# Altium schematic sheet gongye-small-原理图-11-8.SchDoc
size A4
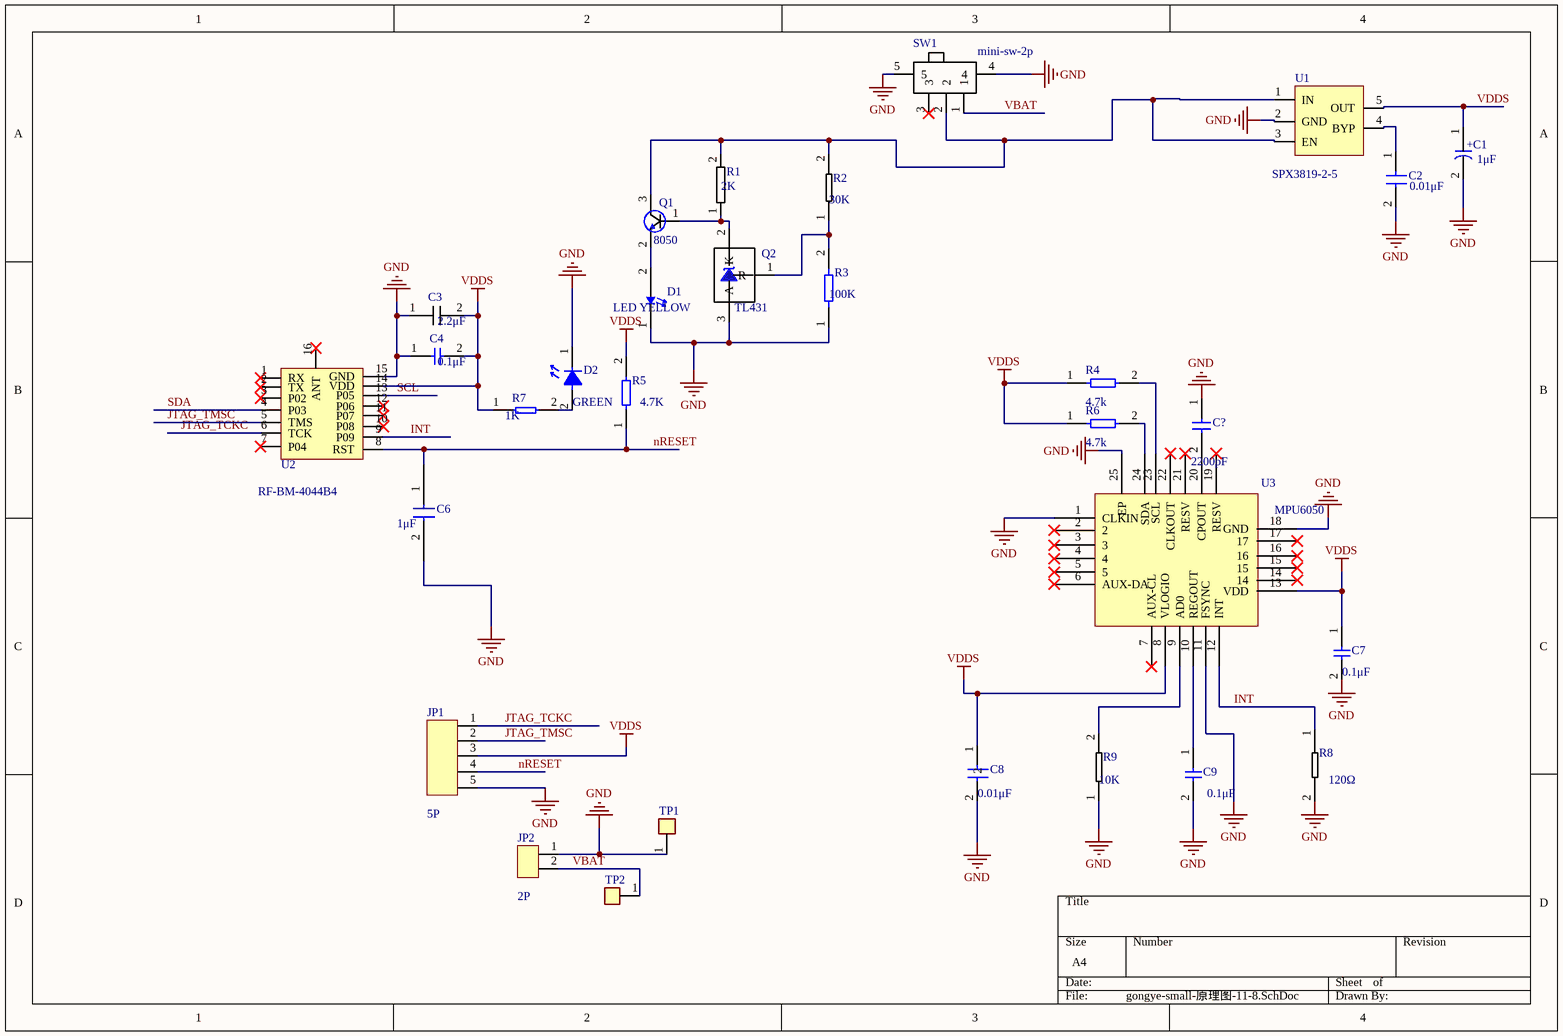
[diagram p0: gongye-small-原理图-11-8.SchDoc]

## Parts
C1  C  1μF TAN  [C 1uF tan]  (value not drawn)
C2  C 0.01μF  [0402--]  (value not drawn)
C3  C 2.2μF  [0402--]  (value not drawn)
C4  C 0.1μF  [0402--]  (value not drawn)
C6  C 1μF  [0402--]  (value not drawn)
C7  C 0.1μF  [0402--]  (value not drawn)
C8  C 0.01μF  [0402--]  (value not drawn)
C9  C 0.1μF  [0402--]  (value not drawn)
C?  C 2200pF  [0402--]  (value not drawn)
D1  D LED yellow  [D LED YELLOW-0603]  (value not drawn)
D2  D LED  [LED-GREEN-BEIGUANG-1206]  (value not drawn)
JP1  JP-5P  [5p-paizhen-1.27]  (value not drawn)
JP2  JP-2P  [2p-cixi-hanpan-3mm]  (value not drawn)
Q1  8050  [8050]
Q2  TL431  [TL431]
R1  R  2K  [0402--]  (value not drawn)
R2  R 30K  [0402--]  (value not drawn)
R3  R 100K  [0402--]  (value not drawn)
R4  R 4.7k  [0402--]  (value not drawn)
R5  R 4.7k  [0402--]  (value not drawn)
R6  R 4.7k  [0402--]  (value not drawn)
R7  R 1K  [0402--]  (value not drawn)
R8  R  120Ω  [0402--]  (value not drawn)
R9  R  10K  [0402--]  (value not drawn)
SW1  mini-SW-2P  [mini-sw-2P]
TP1  TP  [TP--]  (value not drawn)
TP2  TP  [TP--]  (value not drawn)
U1  SPX3819-2-5  [SPX3819]
U2  RF-BM-4044B4  [RF-BM-4044B4]
U3  MPU6050  [MPU6050]

## Nets
GND: C1.2 C2.2 C3.1 C4.1 C6.2 C7.2 C8.2 C9.2 C?.1 D1.1 D2.1 JP1.5 JP2.1 Q2.3(A) R3.1 R8.2 R9.1 SW1.4 SW1.5 TP1.1 U1.2(GND) U2.15(GND) U3.1(CLKIN) U3.11(FSYNC) U3.18(GND) U3.25(EP)
VDDS: C1.1 C3.2 C4.2 C7.1 C8.1 JP1.3 R4.1 R5.2 R6.1 R7.1 U1.5(OUT) U2.14(VDD) U3.8(VLOGIO) U3.13(VDD)
INT: R8.1 U2.9(P09) U3.12(INT)
JTAG_TCKC: JP1.1 U2.6(TCK)
JTAG_TMSC: JP1.2 U2.5(TMS)
nRESET: C6.1 JP1.4 R5.1 U2.8(RST)
SCL: U2.13(P05)
SDA: U2.4(P03)
VBAT: JP2.2 SW1.1 TP2.1
NetC2_1: C2.1 U1.4(BYP)
NetC9_1: C9.1 U3.10(REGOUT)
NetC?_2: C?.2 U3.20(CPOUT)
NetD1_2: D1.2 Q1.2(E)
NetD2_2: D2.2 R7.2
NetQ1_1: Q1.1(B) Q2.2(K) R1.1
NetQ1_3: Q1.3(C) R1.2 R2.2 SW1.2 U1.1(IN) U1.3(EN)
NetQ2_1: Q2.1(R) R2.1 R3.2
NetR4_2: R4.2 U3.23(SCL)
NetR6_2: R6.2 U3.24(SDA)
NetR9_2: R9.2 U3.9(AD0)

Not connected (* = marked no-connect by the designer): SW1 3*; U2 1(RX)* 2(TX)* 3(P02)* 7(P04)* 10(P08)* 11(P07)* 12(P06)* 16(ANT)*; U3 2* 3* 4* 5* 6(AUX-DA)* 7(AUX-CL)* 14* 15* 16* 17* 19(RESV)* 21(RESV)* 22(CLKOUT)*

## Notes on the sheet
- (in symbol C 0.1μF) 0.1μF
- (in symbol C 0.01μF) 0.01μF
- (in symbol C 1μF) 1μF
- (in symbol C 2.2μF) 2.2μF
- (in symbol C 2200pF) 2200pF
- (in symbol C  1μF TAN) +; 1μF
- (in symbol D LED) GREEN
- (in symbol D LED yellow) LED YELLOW
- (in symbol JP-2P) 2P
- (in symbol JP-5P) 5P
- (in symbol mini-SW-2P) mini-sw-2p
- (in symbol R 1K) 1K
- (in symbol R 4.7k) 4.7k; 4.7K
- (in symbol R 30K) 30K
- (in symbol R 100K) 100K
- (in symbol R  2K) 2K
- (in symbol R  10K) 10K
- (in symbol R  120Ω) 120Ω